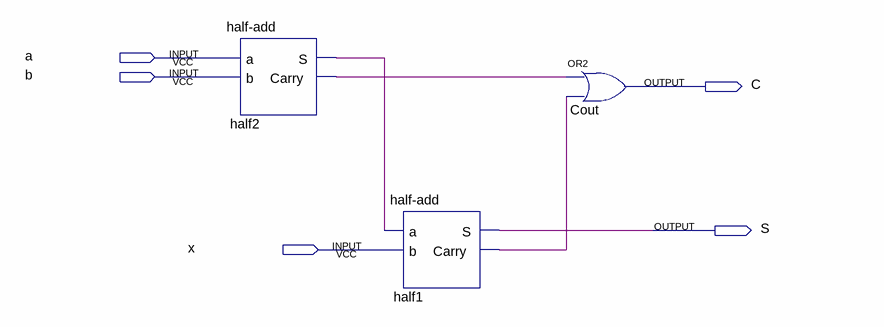
[diagram p0: schematic sheet]
// Quartus schematic all-add.bdf as structural Verilog: 3 symbols, 5 pins
module \all-add  (
  input  a,
  input  b,
  input  x,
  output C,
  output S
);

  wire half1_carry, half2_carry, half2_s;

  \half-add  half2 (.a(a), .b(b), .S(half2_s), .Carry(half2_carry));
  \half-add  half1 (.a(half2_s), .b(x), .S(S), .Carry(half1_carry));
  or Cout (C, half2_carry, half1_carry);
endmodule
